# Altium schematic sheet 2_mcu.SchDoc
size A4; SheetNumber: 2; SheetTotal: 7
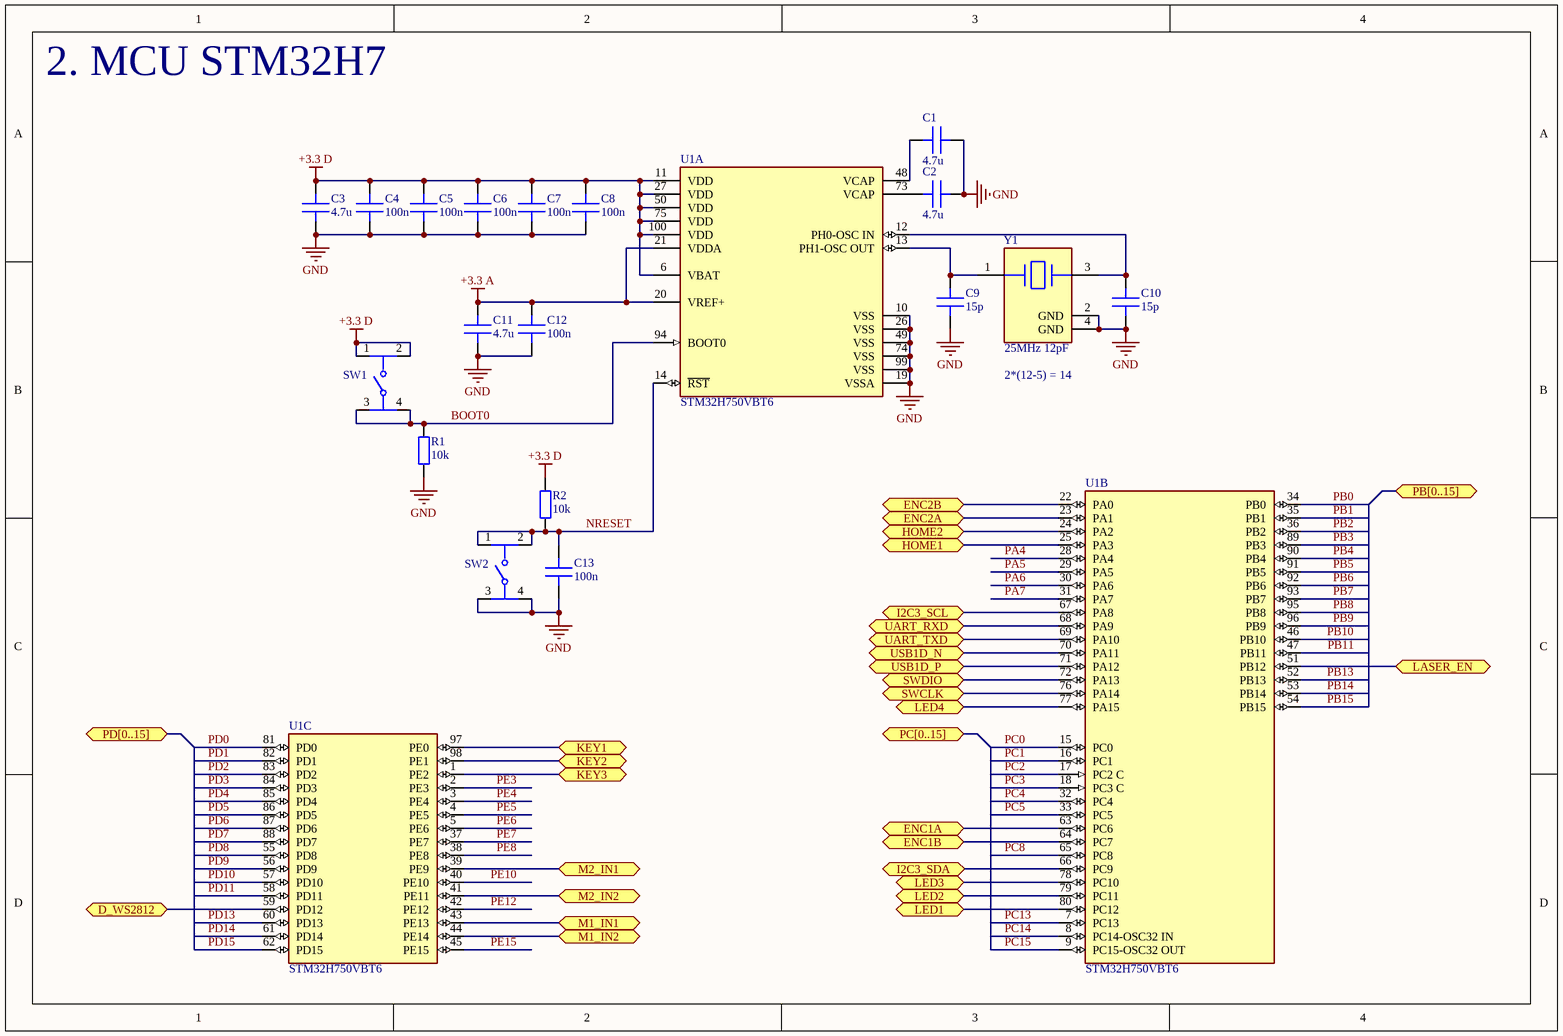
[diagram p0: 2_mcu.SchDoc]

## Parts
C1  4.7u  [IPC C C0603 NO SILK]
C2  4.7u  [IPC C C0603 NO SILK]
C3  4.7u  [IPC C C0603 NO SILK]
C4  100n  [IPC C C0402 NO SILK]
C5  100n  [IPC C C0402 NO SILK]
C6  100n  [IPC C C0402 NO SILK]
C7  100n  [IPC C C0402 NO SILK]
C8  100n  [IPC C C0402 NO SILK]
C9  15p  [IPC C C0402 NO SILK]
C10  15p  [IPC C C0402 NO SILK]
C11  4.7u  [IPC C C0603 NO SILK]
C12  100n  [IPC C C0402 NO SILK]
C13  100n  [IPC C C0402 NO SILK]
R1  10k  [IPC C R0402 NO SILK]
R2  10k  [IPC C R0402 NO SILK]
SW1  PTS810SJM250SMTRLFS  [FP-PTS810SJM250SMTRLFS-MFG]  (value not drawn)
SW2  PTS810SJM250SMTRLFS  [FP-PTS810SJM250SMTRLFS-MFG]  (value not drawn)
U1  STM32H750VBT6  [FP-LQFP100-1L-MFG]  (parts A,B,C of 3)
Y1  ABM8G-25.000MHZ-B4Y-T  [FP-ABM8G-MFG]  (value not drawn)

## Ports
D_WS2812 (bidir, see 7_peripherals[1B]), ENC1A (bidir, see 5_motor driver[4C]), ENC1B (bidir, see 5_motor driver[4C]), ENC2A (bidir, see 5_motor driver[3C]), ENC2B (bidir, see 5_motor driver[3C]), HOME1 (bidir, see 5_motor driver[4C]), HOME2 (bidir, see 5_motor driver[3C]), I2C3_SCL (bidir, see 7_peripherals[4B]), I2C3_SDA (bidir, see 7_peripherals[4B]), KEY1 (bidir, see 7_peripherals[1D]), KEY2 (bidir, see 7_peripherals[2D]), KEY3 (bidir, see 7_peripherals[2D]), LASER_EN (bidir, see 6_laser driver[3C]), LED1 (bidir, see 7_peripherals[1B]), LED2 (bidir, see 7_peripherals[1C]), LED3 (bidir, see 7_peripherals[1C]), LED4 (bidir, see 7_peripherals[1C]), M1_IN1 (bidir, see 5_motor driver[2B]), M1_IN2 (bidir, see 5_motor driver[2B]), M2_IN1 (bidir, see 5_motor driver[1C]), M2_IN2 (bidir, see 5_motor driver[1C]), PB[0..15] (bidir, see 7_peripherals[3C]), PC[0..15] (bidir), PD[0..15] (bidir, see 7_peripherals[3C]), SWCLK (bidir, see 4_connection[3B]), SWDIO (bidir, see 4_connection[3B]), UART_RXD (bidir, see 4_connection[3C]), UART_TXD (bidir, see 4_connection[3C]), USB1D_N (bidir, see 4_connection[2A]), USB1D_P (bidir, see 4_connection[2A])

## Nets
+3.3 A: C11.2 C12.2 U1.20(VREF+) U1.21(VDDA)
+3.3 D: C3.2 C4.2 C5.2 C6.2 C7.2 C8.2 R2.1 SW1.1 SW1.2 U1.6(VBAT) U1.11(VDD) U1.27(VDD) U1.50(VDD) U1.75(VDD) U1.100(VDD)
GND: C1.1 C2.1 C3.1 C4.1 C5.1 C6.1 C7.1 C8.1 C9.1 C10.1 C11.1 C12.1 C13.1 R1.2 SW2.3 SW2.4 U1.10(VSS) U1.19(VSSA) U1.26(VSS) U1.49(VSS) U1.74(VSS) U1.99(VSS) Y1.2(GND) Y1.4(GND)
BOOT0: R1.1 SW1.3 SW1.4 U1.94(BOOT0)
D_WS2812: U1.59(PD12) ; port D_WS2812
ENC1A: U1.63(PC6) ; port ENC1A
ENC1B: U1.64(PC7) ; port ENC1B
ENC2A: U1.23(PA1) ; port ENC2A
ENC2B: U1.22(PA0) ; port ENC2B
HOME1: U1.25(PA3) ; port HOME1
HOME2: U1.24(PA2) ; port HOME2
I2C3_SCL: U1.67(PA8) ; port I2C3_SCL
I2C3_SDA: U1.66(PC9) ; port I2C3_SDA
KEY1: U1.97(PE0) ; port KEY1
KEY2: U1.98(PE1) ; port KEY2
KEY3: U1.1(PE2) ; port KEY3
LASER_EN: U1.51(PB12) ; port LASER_EN
LED1: U1.80(PC12) ; port LED1
LED2: U1.79(PC11) ; port LED2
LED3: U1.78(PC10) ; port LED3
LED4: U1.77(PA15) ; port LED4
M1_IN1: U1.43(PE13) ; port M1_IN1
M1_IN2: U1.44(PE14) ; port M1_IN2
M2_IN1: U1.39(PE9) ; port M2_IN1
M2_IN2: U1.41(PE11) ; port M2_IN2
NRESET: C13.2 R2.2 SW2.1 SW2.2 U1.14(~{RST})
PA4: U1.28(PA4)
PA5: U1.29(PA5)
PA6: U1.30(PA6)
PA7: U1.31(PA7)
PB0: U1.34(PB0)
PB1: U1.35(PB1)
PB2: U1.36(PB2)
PB3: U1.89(PB3)
PB4: U1.90(PB4)
PB5: U1.91(PB5)
PB6: U1.92(PB6)
PB7: U1.93(PB7)
PB8: U1.95(PB8)
PB9: U1.96(PB9)
PB10: U1.46(PB10)
PB11: U1.47(PB11)
PB13: U1.52(PB13)
PB14: U1.53(PB14)
PB15: U1.54(PB15)
PC0: U1.15(PC0)
PC1: U1.16(PC1)
PC2: U1.17(PC2_C)
PC3: U1.18(PC3_C)
PC4: U1.32(PC4)
PC5: U1.33(PC5)
PC8: U1.65(PC8)
PC13: U1.7(PC13)
PC14: U1.8(PC14-OSC32_IN)
PC15: U1.9(PC15-OSC32_OUT)
PD0: U1.81(PD0)
PD1: U1.82(PD1)
PD2: U1.83(PD2)
PD3: U1.84(PD3)
PD4: U1.85(PD4)
PD5: U1.86(PD5)
PD6: U1.87(PD6)
PD7: U1.88(PD7)
PD8: U1.55(PD8)
PD9: U1.56(PD9)
PD10: U1.57(PD10)
PD11: U1.58(PD11)
PD13: U1.60(PD13)
PD14: U1.61(PD14)
PD15: U1.62(PD15)
PE3: U1.2(PE3)
PE4: U1.3(PE4)
PE5: U1.4(PE5)
PE6: U1.5(PE6)
PE7: U1.37(PE7)
PE8: U1.38(PE8)
PE10: U1.40(PE10)
PE12: U1.42(PE12)
PE15: U1.45(PE15)
SWCLK: U1.76(PA14) ; port SWCLK
SWDIO: U1.72(PA13) ; port SWDIO
UART_RXD: U1.68(PA9) ; port UART_RXD
UART_TXD: U1.69(PA10) ; port UART_TXD
USB1D_N: U1.70(PA11) ; port USB1D_N
USB1D_P: U1.71(PA12) ; port USB1D_P
NetC1_2: C1.2 U1.48(VCAP)
NetC2_2: C2.2 U1.73(VCAP)
NetC9_2: C9.2 U1.13(PH1-OSC_OUT) Y1.1
NetC10_2: C10.2 U1.12(PH0-OSC_IN) Y1.3

## Notes on the sheet
- 2. MCU STM32H7
- (near Y1) 25MHz 12pF
- (near Y1) 2*(12-5) = 14

## Library data of the parts
C1-C3 C11 = Generic CAP 0603: Value: 4.7u
C4-C10 C12 C13 = Generic CAP 0402
  C4-C8 C12 C13: Value: 100n
  C9 C10: Value: 15p
R1 R2 = Generic RES 0402: Value: 10k
SW1 SW2 = CMP-10040-000001-2: SWITCH TACTILE SPST-NO 0.05A 16V; Throw Configuration: SPST; Operating Force: 160gf; Actuator Type: Standard; Switch Travel: 0.15mm; Switch Function: Off-Mom; Max Current Rating: 50mA; Mechanical Life: 150000Cycles; Illumination Type: Non-Illuminated; Package Quantity: 2900; Depth: 4.6mm; Mount: Surface Mount; Packaging: Tape and Reel; Length: 3.2mm; RoHS Compliant: Yes; Case/Package: SMD/SMT; Voltage Rating (DC): 16V; Min Operating Temperature: -40°C; Termination: J-Bend; Lead Free: Lead Free; Contact Plating: Silver; Orientation: Straight; Max Operating Temperature: 85°C; Current Rating: 50mA; Color: Black
U1 = CMP-12105-000017-1: IC MCU 32BIT 128KB FLASH 100LQFP; Manufacturer: STMicroelectronics; Number Of Uart Channels: 9; Number Of I/Os: 82; Max Junction Temp: +125°C; Data Bus Width: 32bits; Ram Size: 1MBytes; Min Supply Voltage: 1.62V; Number Of Spi Channels: 6; Number Of Adc Channels: 36; Max Supply Voltage: 3.6V; Standoff Height: 0.05mm; Interface: I2C,SPI,UART,USART,CAN,USB,LIN,IrDA,Ethernet,I2S,Other; Number Of A/D Converters: 3; Number Of I2C Channels: 4; Memory Size: 128KBytes; Frequency: 480MHz; Number Of Timers/Counters: 20; Number Of Ethernet Channels: 1; Core Architecture: ARM Cortex-M7; Number Of Usb Channels: 2; Number Of Pwm Channels: 42; Ambient Temperature Range High: +85°C; Temperature: -40°C to +125°C; ComponentLink2URL: https://www.st.com/resource/en/datasheet/stm32h750vb.pdf; Device Class L2: Embedded Processors and Controllers; Temperature Range Low: -40°C; Octopart: https://octopart.com/stm32h750vbt6-stmicroelectronics-94048547; Category: IC; Manufacturer Part Number: STM32H750VBT6; Height: 1.6mm; Lead Free: Yes; Device Class L1: Integrated Circuits (ICs); Digikey Description: IC MCU 32BIT 128KB FLASH 100LQFP; RoHS: TRUE; Ambient Temperature Range Low: -40°C; Device Class L3: Microcontrollers; ComponentLink2Description: Datasheet; Mouser Description: MCU 32-Bit STM32H750VB ARM Cortex M7 RISC 128KB Flash 1.8V/2.5V/3.3V 100-Pin LQFP Tray; Number Of Cores: 1; Automotive: No; Memory Type: FLASH; Package: LQFP100-1L; Temperature Range High: +125°C
Y1 = CMP-27762-000021-2: Crystal 25MHz ±30ppm (Tol) ±30ppm (Stability) 10pF FUND 60Ω 4-Pin SMD T/R; ESR (Equivalent Series Resistance): 60R; Depth: 2.5mm; Frequency Stability: 30ppm; Mount: Surface Mount; Lead Free: Lead Free; Max Operating Temperature: 70°C; Series: ABM8G; Frequency Tolerance: 30ppm; Min Operating Temperature: -20°C; Number of Pins: 4; Operating Frequency: 25 MHz; Termination: SMD/SMT; Frequency: 25MHz; Case/Package: CSMD; Packaging: Tape and Reel; Package Quantity: 1000; Tolerance: 30ppm; Length: 3.2mm; Height: 0.039inch; Load Capacitance: 10pF; Width: 0.098inch; Series Resistance: 60R